# Altium schematic sheet Filters.SchDoc
size A
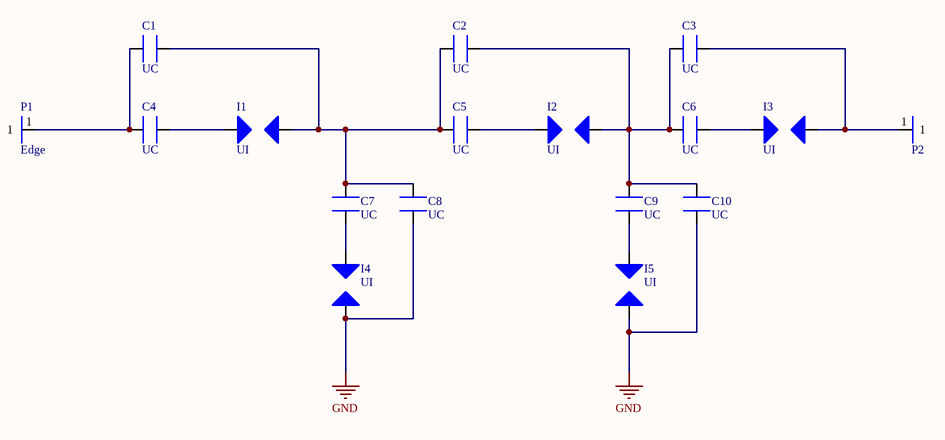
[diagram p0: Filters.SchDoc]

## Parts
C1  UC  [Capacitor]
C2  UC  [Capacitor]
C3  UC  [Capacitor]
C4  UC  [Capacitor]
C5  UC  [Capacitor]
C6  UC  [Capacitor]
C7  UC  [Capacitor]
C8  UC  [Capacitor]
C9  UC  [Capacitor]
C10  UC  [Capacitor]
I1  UI  [Inductor Universal]
I2  UI  [Inductor Universal]
I3  UI  [Inductor Universal]
I4  UI  [Inductor Universal]
I5  UI  [Inductor Universal]
P1  Edge  [Edge Connector]
P2  Edge  [Edge Connector]  (value not drawn)

## Nets
GND: C8.1 C10.1 I4.1 I5.1
NetC1_1: C1.1 C4.1 P1.1
NetC1_2: C1.2 C2.1 C5.1 C7.2 C8.2 I1.2
NetC2_2: C2.2 C3.1 C6.1 C9.2 C10.2 I2.2
NetC3_2: C3.2 I3.2 P2.1
NetC4_2: C4.2 I1.1
NetC5_2: C5.2 I2.1
NetC6_2: C6.2 I3.1
NetC7_1: C7.1 I4.2
NetC9_1: C9.1 I5.2

## Library data of the parts
C1-C10 = Capacitor
I1-I5 = Inductor